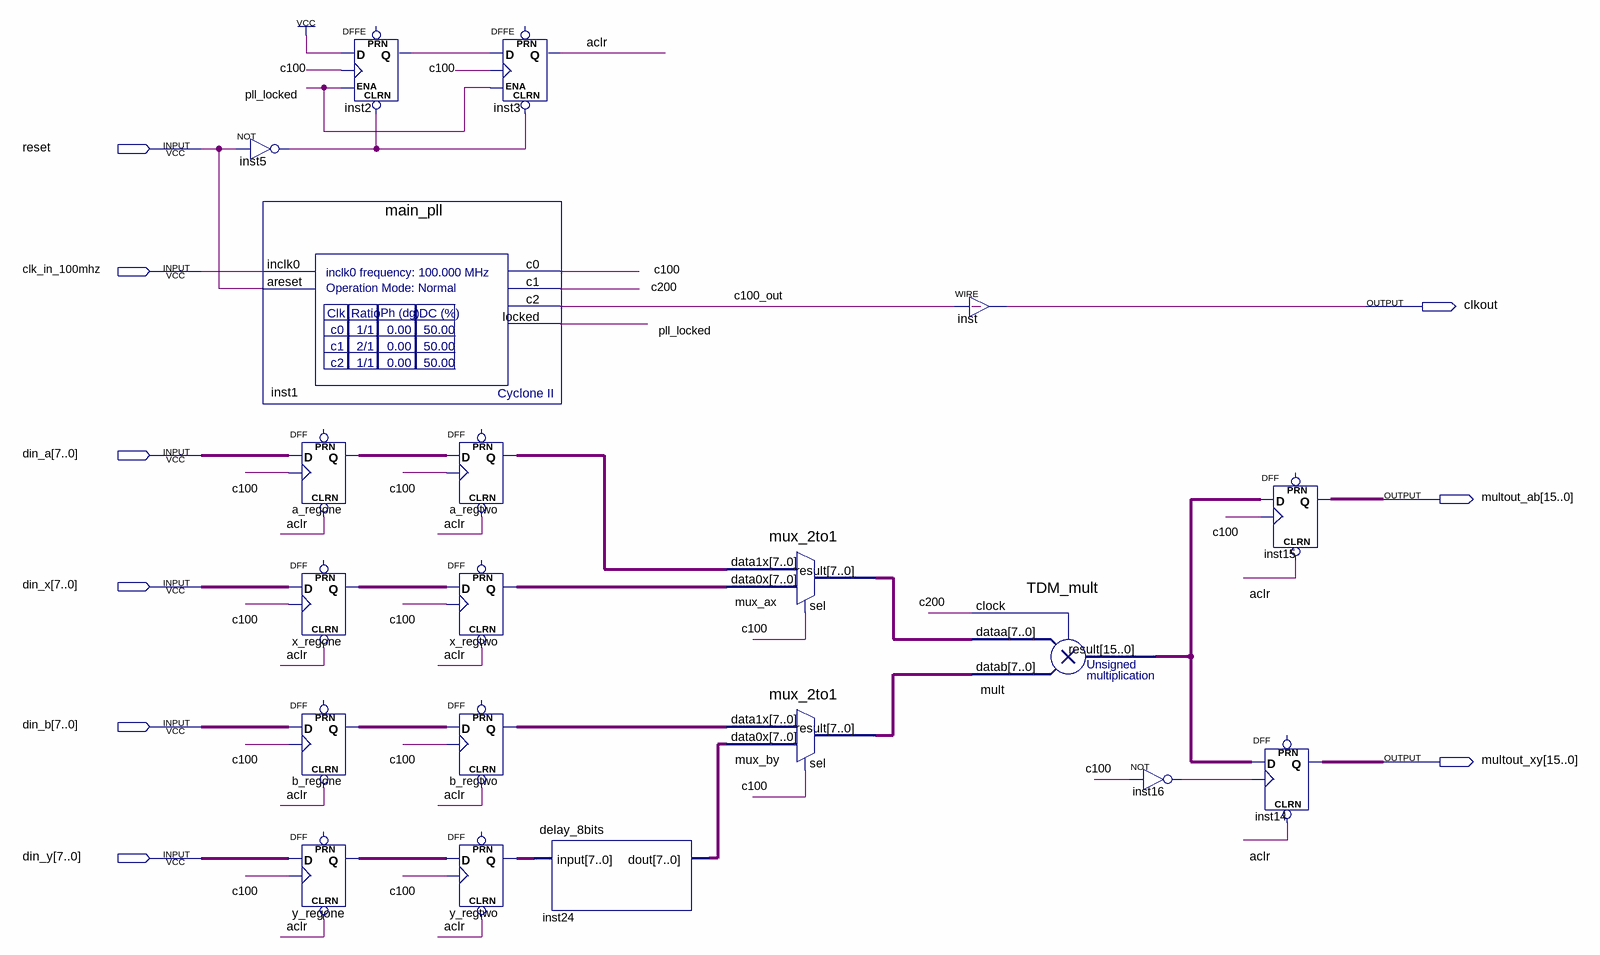
[diagram p0: schematic sheet]
// Quartus schematic top.bdf as structural Verilog: 20 symbols, 9 pins
module top (
  input  reset,
  input  clk_in_100mhz,
  input  [7:0] din_a,
  input  [7:0] din_x,
  input  [7:0] din_b,
  input  [7:0] din_y,
  output clkout,
  output [15:0] multout_ab,
  output [15:0] multout_xy
);

  wire aclr, c100, c100_out, c200, inst2_q, inst5_out, inst16_out, pll_locked;
  wire [7:0] a_regone_q, a_regtwo_q, b_regone_q, b_regtwo_q, inst24_dout, mux_ax_result, mux_by_result,
       x_regone_q, x_regtwo_q, y_regone_q, y_regtwo_q;
  wire [15:0] mult_result;

  not inst5 (inst5_out, reset);
  main_pll inst1 (.inclk0(clk_in_100mhz), .areset(reset), .c0(c100), .c1(c200), .c2(c100_out), .locked(pll_locked));
  DFF a_regone[7:0] (.CLRN(aclr), .CLK(c100), .D(din_a), .Q(a_regone_q));  // open: PRN
  DFF x_regone[7:0] (.CLRN(aclr), .CLK(c100), .D(din_x), .Q(x_regone_q));  // open: PRN
  DFF b_regone[7:0] (.CLRN(aclr), .CLK(c100), .D(din_b), .Q(b_regone_q));  // open: PRN
  DFF y_regone[7:0] (.CLRN(aclr), .CLK(c100), .D(din_y), .Q(y_regone_q));  // open: PRN
  DFFE inst2 (.CLRN(inst5_out), .D(1'b1), .CLK(c100), .ENA(pll_locked), .Q(inst2_q));  // open: PRN
  DFF a_regtwo[7:0] (.CLRN(aclr), .CLK(c100), .D(a_regone_q), .Q(a_regtwo_q));  // open: PRN
  DFF x_regtwo[7:0] (.CLRN(aclr), .CLK(c100), .D(x_regone_q), .Q(x_regtwo_q));  // open: PRN
  DFF b_regtwo[7:0] (.CLRN(aclr), .CLK(c100), .D(b_regone_q), .Q(b_regtwo_q));  // open: PRN
  DFF y_regtwo[7:0] (.CLRN(aclr), .CLK(c100), .D(y_regone_q), .Q(y_regtwo_q));  // open: PRN
  DFFE inst3 (.CLRN(inst5_out), .D(inst2_q), .CLK(c100), .ENA(pll_locked), .Q(aclr));  // open: PRN
  delay_8bits inst24 (.\input (y_regtwo_q), .dout(inst24_dout));
  mux_2to1 mux_ax (.data1x(a_regtwo_q), .data0x(x_regtwo_q), .sel(c100), .result(mux_ax_result));
  mux_2to1 mux_by (.data1x(b_regtwo_q), .data0x(inst24_dout), .sel(c100), .result(mux_by_result));
  assign clkout = c100_out;  // WIRE inst
  TDM_mult mult (.dataa(mux_ax_result), .datab(mux_by_result), .clock(c200), .result(mult_result));
  not inst16 (inst16_out, c100);
  DFF inst15[15:0] (.CLRN(aclr), .CLK(c100), .D(mult_result), .Q(multout_ab));  // open: PRN
  DFF inst14[15:0] (.CLRN(aclr), .CLK(inst16_out), .D(mult_result), .Q(multout_xy));  // open: PRN
endmodule
